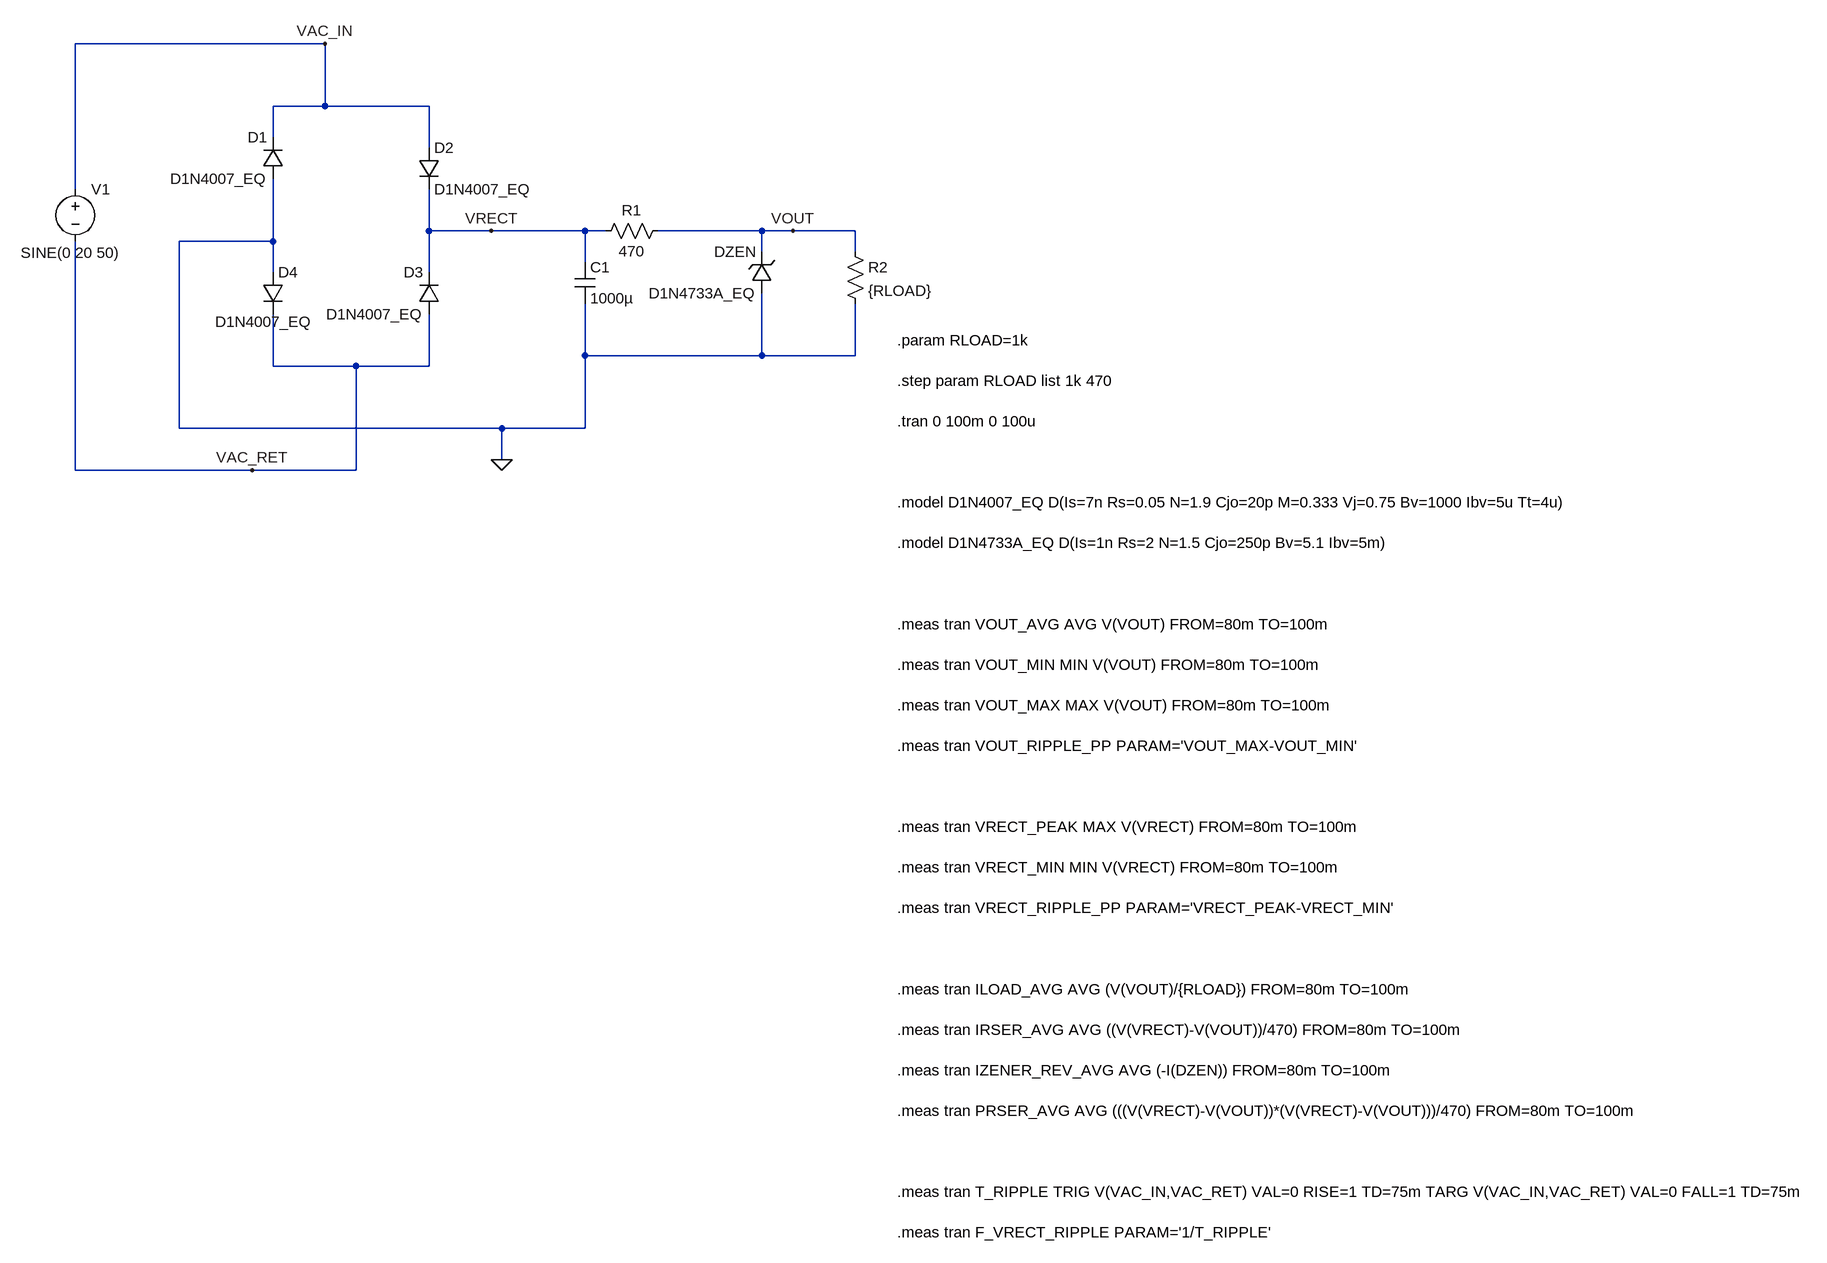
[diagram p0: schematic zener_supply.asc]
zener_supply.asc, the LTspice schematic file:
Version 4.1
SHEET 1 2956 1580
WIRE 624 16 240 16
WIRE 624 112 624 16
WIRE 624 112 544 112
WIRE 784 112 624 112
WIRE 544 160 544 112
WIRE 784 176 784 112
WIRE 240 240 240 16
WIRE 784 304 784 240
WIRE 880 304 784 304
WIRE 1024 304 880 304
WIRE 1056 304 1024 304
WIRE 1296 304 1136 304
WIRE 1344 304 1296 304
WIRE 1440 304 1344 304
WIRE 544 320 544 224
WIRE 544 320 400 320
WIRE 1296 336 1296 304
WIRE 1440 336 1440 304
WIRE 1024 352 1024 304
WIRE 544 368 544 320
WIRE 784 368 784 304
WIRE 1024 496 1024 416
WIRE 1296 496 1296 400
WIRE 1296 496 1024 496
WIRE 1440 496 1440 416
WIRE 1440 496 1296 496
WIRE 544 512 544 432
WIRE 672 512 544 512
WIRE 784 512 784 432
WIRE 784 512 672 512
WIRE 400 608 400 320
WIRE 896 608 400 608
WIRE 1024 608 1024 496
WIRE 1024 608 896 608
WIRE 896 656 896 608
WIRE 240 672 240 320
WIRE 512 672 240 672
WIRE 672 672 672 512
WIRE 672 672 512 672
FLAG 624 16 VAC_IN
FLAG 512 672 VAC_RET
FLAG 880 304 VRECT
FLAG 1344 304 VOUT
FLAG 896 656 0
SYMBOL voltage 240 224 R0
WINDOW 3 -84 114 Left 2
WINDOW 123 0 0 Left 0
WINDOW 39 0 0 Left 0
SYMATTR InstName V1
SYMATTR Value SINE(0 20 50)
SYMBOL diode 560 224 R180
WINDOW 0 24 64 Left 2
WINDOW 3 24 0 Left 2
SYMATTR InstName D1
SYMATTR Value D1N4007_EQ
SYMBOL diode 768 176 R0
SYMATTR InstName D2
SYMATTR Value D1N4007_EQ
SYMBOL diode 800 432 R180
WINDOW 0 24 64 Left 2
WINDOW 3 24 0 Left 2
SYMATTR InstName D3
SYMATTR Value D1N4007_EQ
SYMBOL diode 528 368 R0
WINDOW 3 -73 76 Left 2
SYMATTR InstName D4
SYMATTR Value D1N4007_EQ
SYMBOL res 1152 288 R90
WINDOW 0 0 56 VBottom 2
WINDOW 3 32 56 VTop 2
SYMATTR InstName R1
SYMATTR Value 470
SYMBOL cap 1008 352 R0
SYMATTR InstName C1
SYMATTR Value 1000µ
SYMBOL res 1424 320 R0
SYMATTR InstName R2
SYMATTR Value {RLOAD}
SYMBOL zener 1312 400 R180
WINDOW 0 24 64 Left 2
WINDOW 3 24 0 Left 2
SYMATTR InstName DZEN
SYMATTR Value D1N4733A_EQ
TEXT 1504 472 Left 2 !.param RLOAD=1k\n \n.step param RLOAD list 1k 470\n \n.tran 0 100m 0 100u\n \n\n \n.model D1N4007_EQ D(Is=7n Rs=0.05 N=1.9 Cjo=20p M=0.333 Vj=0.75 Bv=1000 Ibv=5u Tt=4u)\n \n.model D1N4733A_EQ D(Is=1n Rs=2 N=1.5 Cjo=250p Bv=5.1 Ibv=5m)\n \n\n \n.meas tran VOUT_AVG AVG V(VOUT) FROM=80m TO=100m\n \n.meas tran VOUT_MIN MIN V(VOUT) FROM=80m TO=100m\n \n.meas tran VOUT_MAX MAX V(VOUT) FROM=80m TO=100m\n \n.meas tran VOUT_RIPPLE_PP PARAM='VOUT_MAX-VOUT_MIN'\n \n\n \n.meas tran VRECT_PEAK MAX V(VRECT) FROM=80m TO=100m\n \n.meas tran VRECT_MIN MIN V(VRECT) FROM=80m TO=100m\n \n.meas tran VRECT_RIPPLE_PP PARAM='VRECT_PEAK-VRECT_MIN'\n \n\n \n.meas tran ILOAD_AVG AVG (V(VOUT)/{RLOAD}) FROM=80m TO=100m\n \n.meas tran IRSER_AVG AVG ((V(VRECT)-V(VOUT))/470) FROM=80m TO=100m\n \n.meas tran IZENER_REV_AVG AVG (-I(DZEN)) FROM=80m TO=100m\n \n.meas tran PRSER_AVG AVG (((V(VRECT)-V(VOUT))*(V(VRECT)-V(VOUT)))/470) FROM=80m TO=100m\n \n\n \n.meas tran T_RIPPLE TRIG V(VAC_IN,VAC_RET) VAL=0 RISE=1 TD=75m TARG V(VAC_IN,VAC_RET) VAL=0 FALL=1 TD=75m\n \n.meas tran F_VRECT_RIPPLE PARAM='1/T_RIPPLE'

The netlist it stands for:
* zener_supply.asc
V1 VAC_IN VAC_RET SINE(0 20 50)
D1 0 VAC_IN D1N4007_EQ
D2 VAC_IN VRECT D1N4007_EQ
D3 VAC_RET VRECT D1N4007_EQ
D4 0 VAC_RET D1N4007_EQ
R1 VOUT VRECT 470
C1 VRECT 0 1000µ
R2 VOUT 0 {RLOAD}
DZEN 0 VOUT D1N4733A_EQ
.model D D
.lib standard.dio
.param RLOAD=1k
.step param RLOAD list 1k 470
.tran 0 100m 0 100u
.model D1N4007_EQ D(Is=7n Rs=0.05 N=1.9 Cjo=20p M=0.333 Vj=0.75 Bv=1000 Ibv=5u Tt=4u)
.model D1N4733A_EQ D(Is=1n Rs=2 N=1.5 Cjo=250p Bv=5.1 Ibv=5m)
.meas tran VOUT_AVG AVG V(VOUT) FROM=80m TO=100m
.meas tran VOUT_MIN MIN V(VOUT) FROM=80m TO=100m
.meas tran VOUT_MAX MAX V(VOUT) FROM=80m TO=100m
.meas tran VOUT_RIPPLE_PP PARAM='VOUT_MAX-VOUT_MIN'
.meas tran VRECT_PEAK MAX V(VRECT) FROM=80m TO=100m
.meas tran VRECT_MIN MIN V(VRECT) FROM=80m TO=100m
.meas tran VRECT_RIPPLE_PP PARAM='VRECT_PEAK-VRECT_MIN'
.meas tran ILOAD_AVG AVG (V(VOUT)/{RLOAD}) FROM=80m TO=100m
.meas tran IRSER_AVG AVG ((V(VRECT)-V(VOUT))/470) FROM=80m TO=100m
.meas tran IZENER_REV_AVG AVG (-I(DZEN)) FROM=80m TO=100m
.meas tran PRSER_AVG AVG (((V(VRECT)-V(VOUT))*(V(VRECT)-V(VOUT)))/470) FROM=80m TO=100m
.meas tran T_RIPPLE TRIG V(VAC_IN,VAC_RET) VAL=0 RISE=1 TD=75m TARG V(VAC_IN,VAC_RET) VAL=0 FALL=1 TD=75m
.meas tran F_VRECT_RIPPLE PARAM='1/T_RIPPLE'
.backanno
.end